# Altium schematic sheet DMB_Solenoids.SchDoc
size A4; SheetNumber: 2; SheetTotal: 2
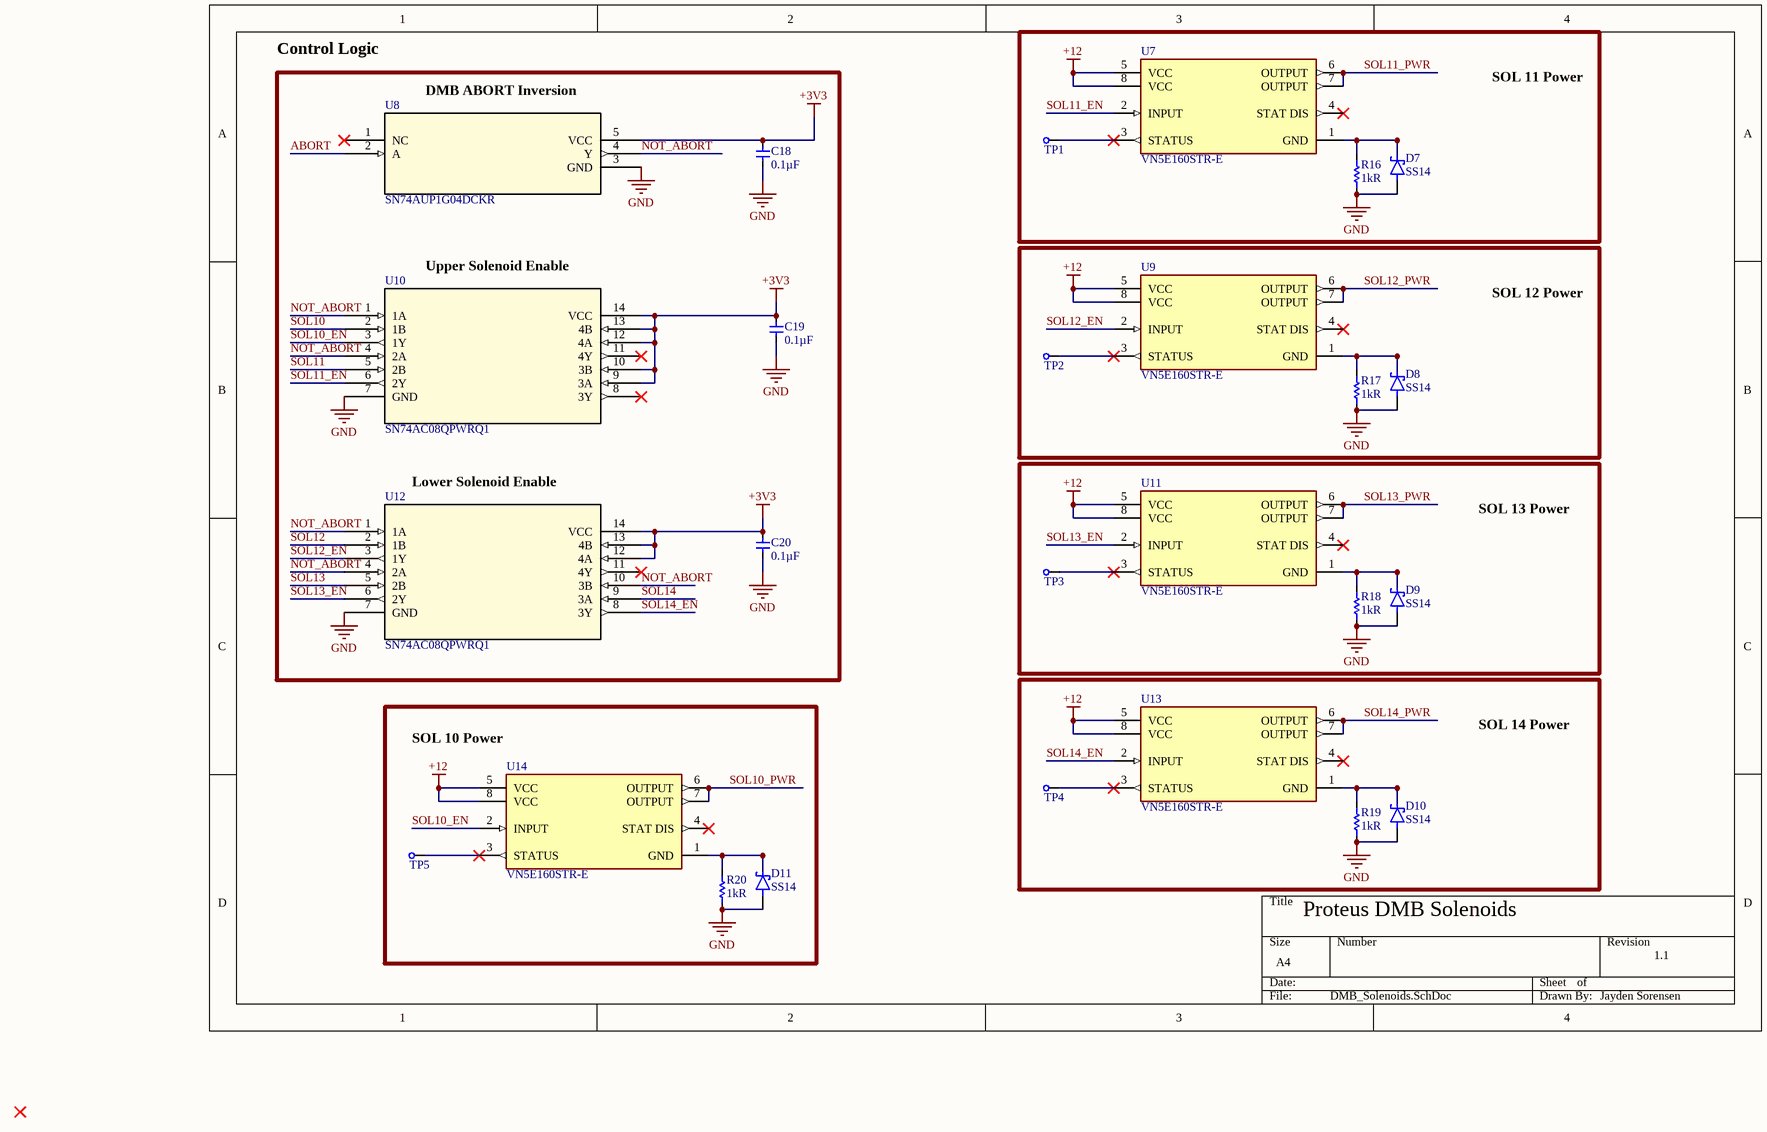
[diagram p0: DMB_Solenoids.SchDoc]

## Parts
C18  Capacitance: 0.1µF  [0603]  (hidden comment: CGA3E2X7R1E104K080AA)
C19  Capacitance: 0.1µF  [0603]  (hidden comment: CGA3E2X7R1E104K080AA)
C20  Capacitance: 0.1µF  [0603]  (hidden comment: CGA3E2X7R1E104K080AA)
D7  SS14  [DIOM4325X250N]
D8  SS14  [DIOM4325X250N]
D9  SS14  [DIOM4325X250N]
D10  SS14  [DIOM4325X250N]
D11  SS14  [DIOM4325X250N]
R16  Resistance: 1kR  [0603]  (hidden comment: RC0603FR-071KL)
R17  Resistance: 1kR  [0603]  (hidden comment: RC0603FR-071KL)
R18  Resistance: 1kR  [0603]  (hidden comment: RC0603FR-071KL)
R19  Resistance: 1kR  [0603]  (hidden comment: RC0603FR-071KL)
R20  Resistance: 1kR  [0603]  (hidden comment: RC0603FR-071KL)
TP1  Testpoint  [Testpoint]  (value not drawn)  (no BOM)
TP2  Testpoint  [Testpoint]  (value not drawn)  (no BOM)
TP3  Testpoint  [Testpoint]  (value not drawn)  (no BOM)
TP4  Testpoint  [Testpoint]  (value not drawn)  (no BOM)
TP5  Testpoint  [Testpoint]  (value not drawn)  (no BOM)
U7  VN5E160STR-E  [VN5E160STR-E]
U8  SN74AUP1G04DCKR  [SN74AUP1G04DCKR]
U9  VN5E160STR-E  [VN5E160STR-E]
U10  SN74AC08QPWRQ1  [SN74AC08QPWRQ1]
U11  VN5E160STR-E  [VN5E160STR-E]
U12  SN74AC08QPWRQ1  [SN74AC08QPWRQ1]
U13  VN5E160STR-E  [VN5E160STR-E]
U14  VN5E160STR-E  [VN5E160STR-E]

## Blocks framed on the sheet
Control Logic: C18-C20 U8 U10 U12
SOL 11 Power: D7 R16 TP1 U7
SOL 12 Power: D8 R17 TP2 U9
SOL 13 Power: D9 R18 TP3 U11
SOL 10 Power: D11 R20 TP5 U14
SOL 14 Power: D10 R19 TP4 U13

## Nets
+3V3: C18.2 C19.2 C20.2 U8.5(VCC) U10.9(3A) U10.10(3B) U10.12(4A) U10.13(4B) U10.14(VCC) U12.12(4A) U12.13(4B) U12.14(VCC)
+12: U7.5(VCC) U7.8(VCC) U9.5(VCC) U9.8(VCC) U11.5(VCC) U11.8(VCC) U13.5(VCC) U13.8(VCC) U14.5(VCC) U14.8(VCC)
GND: C18.1 C19.1 C20.1 D7.A D8.A D9.A D10.A D11.A R16.1 R17.2 R18.2 R19.2 R20.2 U8.3(GND) U10.7(GND) U12.7(GND)
ABORT: U8.2(A)
NOT_ABORT: U8.4(Y) U10.1(1A) U10.4(2A) U12.1(1A) U12.4(2A) U12.10(3B)
SOL10: U10.2(1B)
SOL10_EN: U10.3(1Y) U14.2(INPUT)
SOL10_PWR: U14.6(OUTPUT) U14.7(OUTPUT)
SOL11: U10.5(2B)
SOL11_EN: U7.2(INPUT) U10.6(2Y)
SOL11_PWR: U7.6(OUTPUT) U7.7(OUTPUT)
SOL12: U12.2(1B)
SOL12_EN: U9.2(INPUT) U12.3(1Y)
SOL12_PWR: U9.6(OUTPUT) U9.7(OUTPUT)
SOL13: U12.5(2B)
SOL13_EN: U11.2(INPUT) U12.6(2Y)
SOL13_PWR: U11.6(OUTPUT) U11.7(OUTPUT)
SOL14: U12.9(3A)
SOL14_EN: U12.8(3Y) U13.2(INPUT)
SOL14_PWR: U13.6(OUTPUT) U13.7(OUTPUT)
NetD7_C: D7.C(K) R16.2 U7.1(GND)
NetD8_C: D8.C(K) R17.1 U9.1(GND)
NetD9_C: D9.C(K) R18.1 U11.1(GND)
NetD10_C: D10.C(K) R19.1 U13.1(GND)
NetD11_C: D11.C(K) R20.1 U14.1(GND)
NetTP1_1: TP1.1 U7.3(STATUS)
NetTP2_1: TP2.1 U9.3(STATUS)
NetTP3_1: TP3.1 U11.3(STATUS)
NetTP4_1: TP4.1 U13.3(STATUS)
NetTP5_1: TP5.1 U14.3(STATUS)

Not connected (* = marked no-connect by the designer): U7 4(STAT_DIS)*; U8 1(NC)*; U9 4(STAT_DIS)*; U10 8(3Y)* 11(4Y)*; U11 4(STAT_DIS)*; U12 11(4Y)*; U13 4(STAT_DIS)*; U14 4(STAT_DIS)*

## Notes on the sheet
- (near U8) DMB ABORT Inversion
- (near U10) Upper Solenoid Enable
- (near U12) Lower Solenoid Enable
- Proteus DMB Solenoids
- 1.1
- Jayden Sorensen

## Library data of the parts
C18-C20 = CGA3E2X7R1E104K080AA: CAP CER 0.1UF 25V X7R 0603; Manufacturer: TDK Corporation; Tolerance: ±10%; Temperature Coefficient: X7R; Operating Temperature: -55°C ~ 125°C; Mounting Type: Surface Mount, MLCC; Package / Case: 0603 (1608 Metric); Size / Dimension: 0.063" L x 0.031" W (1.60mm x 0.80mm); Manufacturer Part Number: CGA3E2X7R1E104K080AA; Thickness (Max): 0.035" (0.90mm); ComponentLink1Description: Datasheet; ComponentLink1URL: https://product.tdk.com/info/en/catalog/spec/mlccspec_automotive_general_en.pdf; Supplier 1: Digi-Key; Supplier Part Number 1: 445-5667-1-ND
D7-D11 = SS14: Schottky Diodes & Rectifiers 40V 1A; Value: *; Availability: Unavailable; Price: None; Package: None; MP: SS14
R16-R20 = RC0603FR-071KL: Res Thick Film 0603 1K Ohm 1% 1/10W ±100ppm/°C Molded SMD SMD Paper T/R; Manufacturer: Yageo; Power Rating: 100mW; Voltage Rating: 50V; Supplier 1: Future Electronics; Supplier Part Number 1: 4016291; Manufacturer Part Number: RC0603FR-071KL; RoHS: Yes; Category: Chip SMD Resistors; Stock: 11600000; Pricing: 5000=0.0015, 50000=0.0014, 200000=0.0014, 625000=0.0013, 2000000=0.0012 (USD); Case/Package: 0603; Contact Plating: Tin,Matte; Case Code (Imperial): 0603; Case Code (Metric): 1608; Size Code: 0603; Min Operating Temperature: -55°C; Max Operating Temperature: 155°C; Tolerance: 1%; Temperature Coefficient: 100ppm/°C; Resistor Type: Thick Film; Packaging: Tape and Reel; Termination: SMD/SMT; Features: Moisture Resistant; Series: RC; Max Power Dissipation: 100mW; Number of Terminations: 2; Technology: THICK FILM; Resistance Tolerance: 1%; Construction: Rectangular; Length: 1.6mm; Height: 0.45mm; Depth: 0.8mm; Reach SVHC Compliant: No; Military Standard: Not; Lead Free: Lead Free; RoHS Compliant: Yes; ComponentLink1URL: https://datasheet.ciiva.com/11808/0900766b80f96399-11808081.pdf?src-supplier=Rs; ComponentLink1Description: https://datasheet.ciiva.com/11808/0900766b80f96399-11808081.pdf?src-supplier=Rs; ComponentLink2URL: https://datasheet.ciiva.com/7746/1686128-7746280.pdf?src-supplier=Element14; ComponentLink2Description: https://datasheet.ciiva.com/7746/1686128-7746280.pdf?src-supplier=Element14; ComponentLink3URL: https://datasheet.ciiva.com/7660/1868787-7660790.pdf?src-supplier=Element14; ComponentLink3Description: https://datasheet.ciiva.com/7660/1868787-7660790.pdf?src-supplier=Element14; ComponentLink4URL: https://datasheet.ciiva.com/7983/443971-7983613.pdf?src-supplier=Element14; ComponentLink4Description: https://datasheet.ciiva.com/7983/443971-7983613.pdf?src-supplier=Element14; ComponentLink5URL: https://datasheet.ciiva.com/7746/1738695-7746281.pdf?src-supplier=Element14; ComponentLink5Description: https://datasheet.ciiva.com/7746/1738695-7746281.pdf?src-supplier=Element14; ComponentLink6URL: https://datasheet.ciiva.com/7746/1738695-7746279.pdf?src-supplier=Element14; ComponentLink6Description: https://datasheet.ciiva.com/7746/1738695-7746279.pdf?src-supplier=Element14; ComponentLink7URL: https://datasheet.ciiva.com/8896/pyu-rc0603-51-rohs-l-4-8896106.pdf?src-supplier=Avnet; ComponentLink7Description: https://datasheet.ciiva.com/8896/pyu-rc0603-51-rohs-l-4-8896106.pdf?src-supplier=Avnet; ComponentLink8URL: https://datasheet.ciiva.com/15189/getdatasheetpartid-404327-15189644.pdf?src-supplier=Verical; ComponentLink8Description: https://datasheet.ciiva.com/15189/getdatasheetpartid-404327-15189644.pdf?src-supplier=Verical
TP1-TP5 = Testpoint: TESTPOINT 0.7MMD Hole, 1.2MMW, 1.2MML
U7 U9 U11 U13 U14 = VN5E160STR-E: Single channel high side driver for automotive applications in a SO-8 package.; Manufacturer: STMicroelectronics; Max Supply Voltage: 28V; Min Supply Voltage: 4.5V; Number of Outputs: 1; Max Supply Current: 3.5mA; Max Output Current: 10A; Operating Supply Voltage: 13V; On-State Resistance: 160mR; Output Current per Channel: 7A; Turn-Off Delay Time: 15us; Turn-On Delay Time: 10us; Supplier 1: RSComponents; Supplier Part Number 1: 1906863P; Manufacturer Part Number: VN5E160STR-E; RoHS: Yes; Category: Hot Swap Controllers; Stock: 7410; Pricing: 50=1.40400, 100=1.33000, 250=1.25500, 500=1.19700 (GBP); Mount: Surface Mount; Case/Package: SOIC; Number of Pins: 8; Min Operating Temperature: -40°C; Max Operating Temperature: 150°C; Packaging: Tape and Reel; Package Quantity: 2500; Output Current: 10A; Nominal Supply Current: 3.5mA; Number of Drivers: 1; Series: VIPower™; Supply Current: 3.5mA; Radiation Hardening: No; Lead Free: Lead Free; RoHS Compliant: Yes; ComponentLink1URL: https://datasheet.ciiva.com/12213/cd00161993-115163-12213649.pdf?src-supplier=Mouser; ComponentLink1Description: https://datasheet.ciiva.com/12213/cd00161993-115163-12213649.pdf?src-supplier=Mouser; ComponentLink2URL: https://datasheet.ciiva.com/16510/cd00161993-16510912.pdf?src-supplier=Future+Electronics; ComponentLink2Description: https://datasheet.ciiva.com/16510/cd00161993-16510912.pdf?src-supplier=Future+Electronics; ComponentLink3URL: https://datasheet.ciiva.com/1956/cd00161993-1956305.pdf?src-supplier=Digi-Key; ComponentLink3Description: https://datasheet.ciiva.com/1956/cd00161993-1956305.pdf?src-supplier=Digi-Key
U8 = SN74AUP1G04DCKR: Inverters Lo-Pwr Single Inverter Gate A 595-SN74AUP1G04DCKT
U10 U12 = SN74AC08QPWRQ1: Logic Gates Auto Cat Quad 2 Inp Positive AND Gates A 595-SN74AC08QPWRG4Q1